# EAGLE design CPLD_Class (EAGLE 5.11)

## Sheet 1 of 6
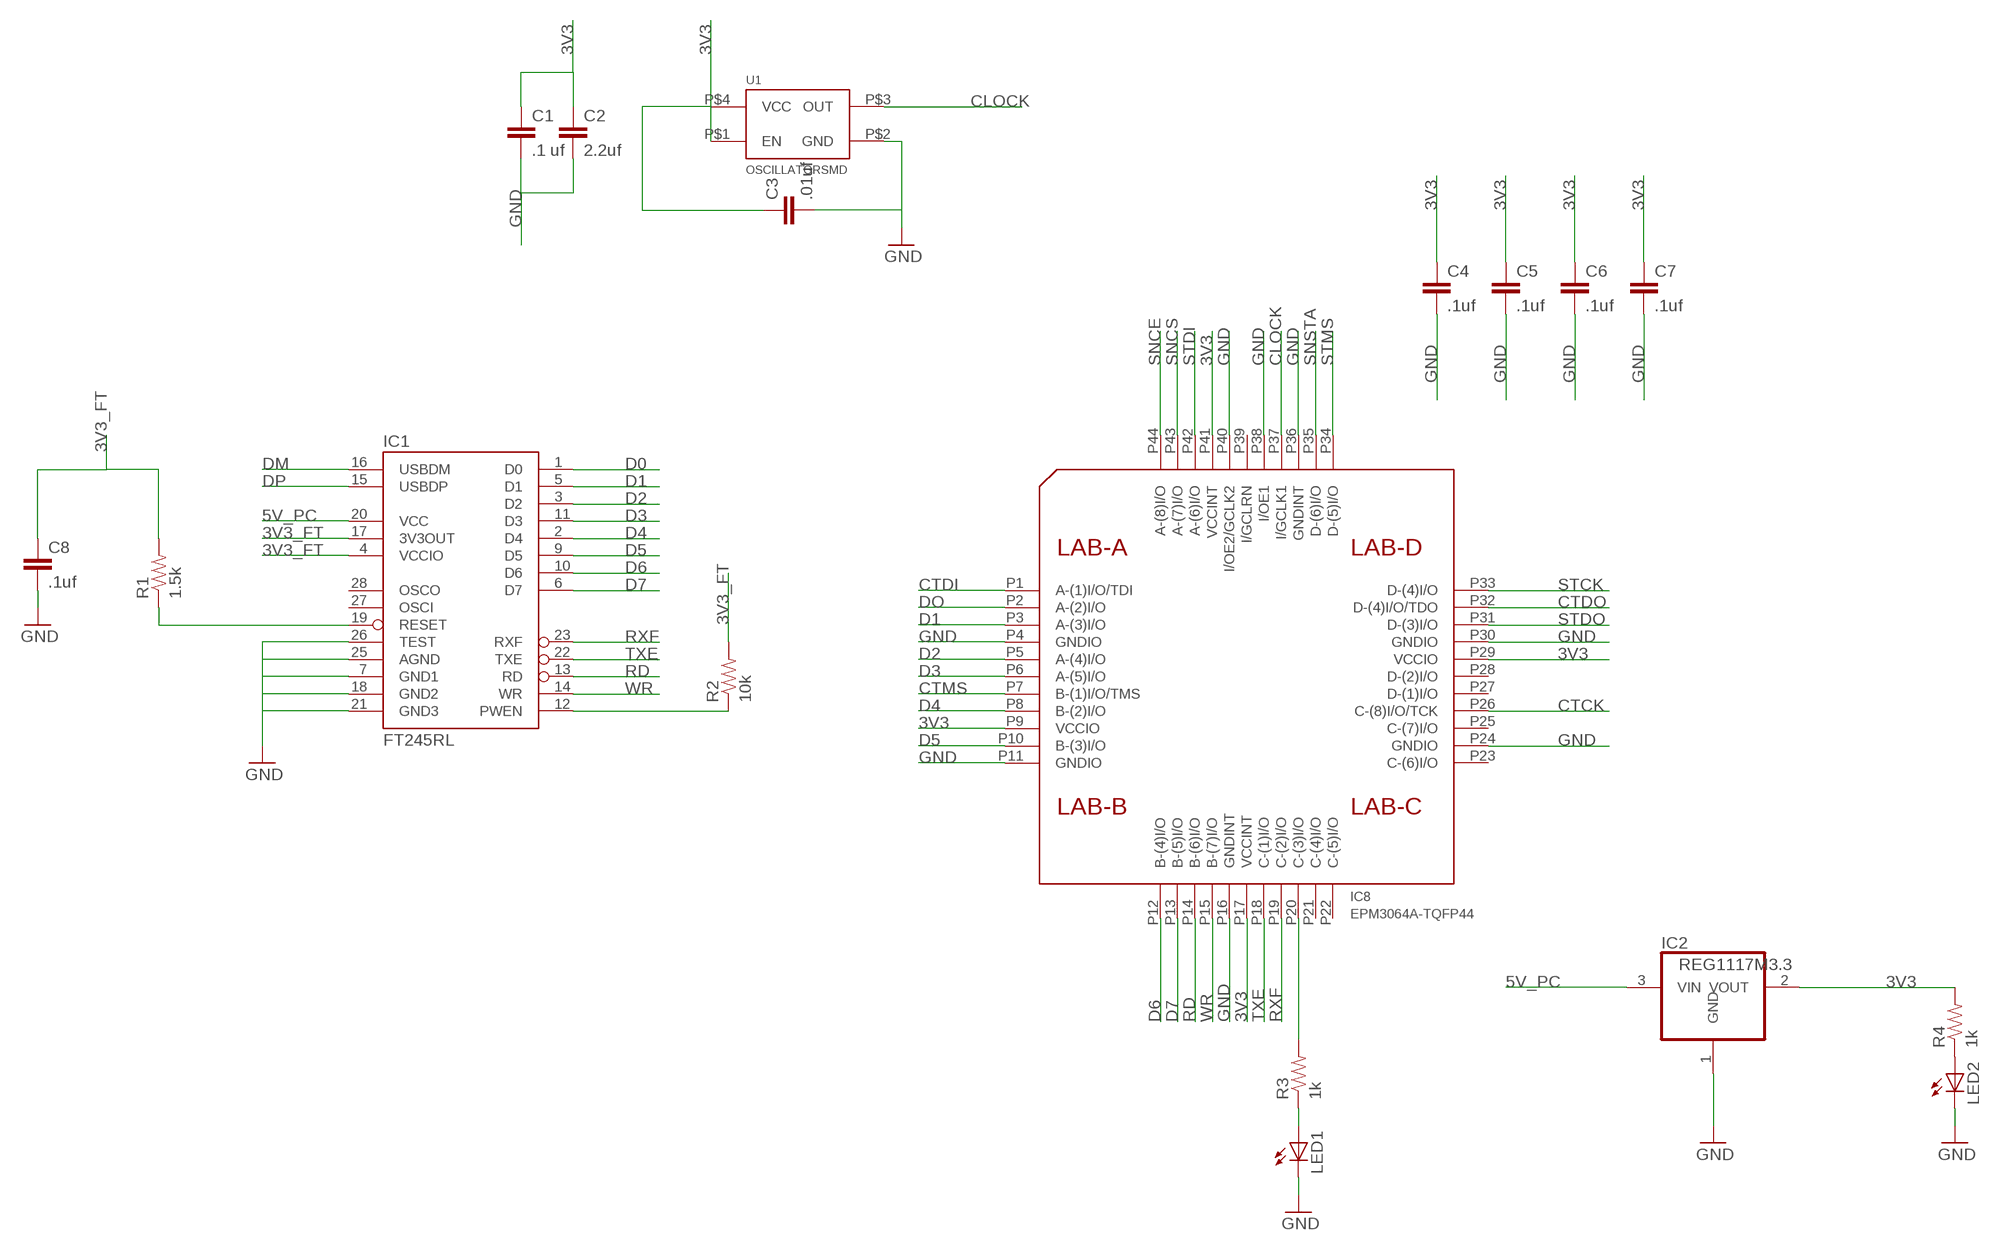
[diagram p0: schematic, sheet 1]

### Parts
C1  .1 uf  CAP0805  [0805]
C2  2.2uf  CAP0805  [0805]
C3  .01uf  CAP0805  [0805]
C4  .1uf  CAP0805  [0805]
C5  .1uf  CAP0805  [0805]
C6  .1uf  CAP0805  [0805]
C7  .1uf  CAP0805  [0805]
C8  .1uf  CAP0805  [0805]
IC1  FT245RL  [SSOP28DB]
IC2  REG1117M3.3  REG1117  [SOT223]
IC8  EPM3064A-TQFP44  [TQFP44]
LED1  LEDCHIPLED_1206  [CHIPLED_1206]
LED2  LEDCHIPLED_1206  [CHIPLED_1206]
R1  1.5k  RESISTOR  [0805]
R2  10k  RESISTOR  [0805]
R3  1k  RESISTOR  [0805]
R4  1k  RESISTOR  [0805]
U1  OSCILLATORSMD  [CRYSTAL-SMD-7X5]

### Nets
3V3: C1.1 C2.1 C3.1 C4.1 C5.1 C6.1 C7.1 IC2.2(VOUT) IC8.P9(VCCIO) IC8.P17(VCCINT) IC8.P29(VCCIO) IC8.P41(VCCINT) R4.2 U1.P$1(EN) U1.P$4(VCC) ; also sheet 3,4
3V3_FT: C8.1 IC1.4(VCCIO) IC1.17(3V3OUT) R1.2 R2.2
5V_PC: IC1.20(VCC) IC2.3(VIN) ; also sheet 2
CLOCK: IC8.P37(I/GCLK1) U1.P$3(OUT)
CTCK: IC8.P26(C-(8)I/O/TCK) ; also sheet 3
CTDI: IC8.P1(A-(1)I/O/TDI) ; also sheet 3
CTDO: IC8.P32(D-(4)I/O/TDO) ; also sheet 3
CTMS: IC8.P7(B-(1)I/O/TMS) ; also sheet 3
D0: IC1.1(D0)
D1: IC1.5(D1) IC8.P3(A-(3)I/O)
D2: IC1.3(D2) IC8.P5(A-(4)I/O)
D3: IC1.11(D3) IC8.P6(A-(5)I/O)
D4: IC1.2(D4) IC8.P8(B-(2)I/O)
D5: IC1.9(D5) IC8.P10(B-(3)I/O)
D6: IC1.10(D6) IC8.P12(B-(4)I/O)
D7: IC1.6(D7) IC8.P13(B-(5)I/O)
DM: IC1.16(USBDM) ; also sheet 2
DO: IC8.P2(A-(2)I/O)
DP: IC1.15(USBDP) ; also sheet 2
GND: C1.2 C2.2 C3.2 C4.2 C5.2 C6.2 C7.2 C8.2 IC1.7(GND1) IC1.18(GND2) IC1.21(GND3) IC1.25(AGND) IC1.26(TEST) IC2.1(GND) IC8.P4(GNDIO) IC8.P11(GNDIO) IC8.P16(GNDINT) IC8.P24(GNDIO) IC8.P30(GNDIO) IC8.P36(GNDINT) IC8.P38(I/OE1) IC8.P40(I/OE2/GCLK2) LED1.C LED2.C U1.P$2(GND) ; also sheet 2,3,4,5,6
N$2: LED2.A R4.1
N$3: LED1.A R3.1
N$4: IC1.19(RESET) R1.1
N$8: IC1.12(PWEN) R2.1
N$13: IC8.P20(C-(3)I/O) R3.2
RD: IC1.13(RD) IC8.P14(B-(6)I/O)
RXF: IC1.23(RXF) IC8.P19(C-(2)I/O)
SNCE: IC8.P44(A-(8)I/O) ; also sheet 4
SNCS: IC8.P43(A-(7)I/O) ; also sheet 4
SNSTA: IC8.P35(D-(6)I/O) ; also sheet 4
STCK: IC8.P33(D-(4)I/O) ; also sheet 4
STDI: IC8.P42(A-(6)I/O) ; also sheet 4
STDO: IC8.P31(D-(3)I/O) ; also sheet 4
STMS: IC8.P34(D-(5)I/O) ; also sheet 4
TXE: IC1.22(TXE) IC8.P18(C-(1)I/O)
WR: IC1.14(WR) IC8.P15(B-(7)I/O)
Unconnected: IC1.27(OSCI) IC1.28(OSCO) IC8.P21(C-(4)I/O) IC8.P22(C-(5)I/O) IC8.P23(C-(6)I/O) IC8.P25(C-(7)I/O) IC8.P27(D-(1)I/O) IC8.P28(D-(2)I/O) IC8.P39(I/GCLRN)

## Sheet 2 of 6
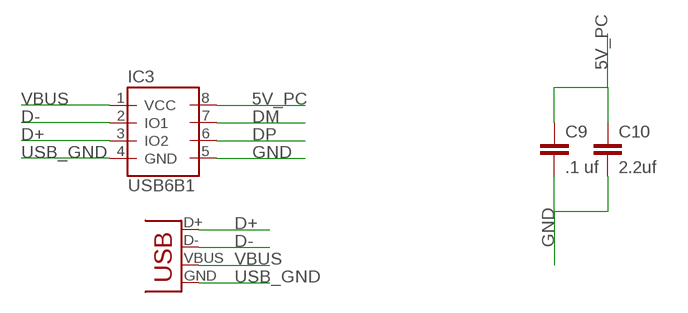
[diagram p1: schematic, sheet 2]

### Parts
C9  .1 uf  CAP0805  [0805]
C10  2.2uf  CAP0805  [0805]
IC3  USB6B1  [SO08]
USB1  USB-SMD-NS  [USB-MINIB-NOSTOP]

### Nets
5V_PC: C9.1 C10.1 IC3.8(VCC) ; also sheet 1
D+: IC3.3(IO2) USB1.D+
D-: IC3.2(IO1) USB1.D-
DM: IC3.7(IO1) ; also sheet 1
DP: IC3.6(IO2) ; also sheet 1
GND: C9.2 C10.2 IC3.5(GND) ; also sheet 1,3,4,5,6
USB_GND: IC3.4(GND) USB1.GND
VBUS: IC3.1(VCC) USB1.VBUS

## Sheet 3 of 6
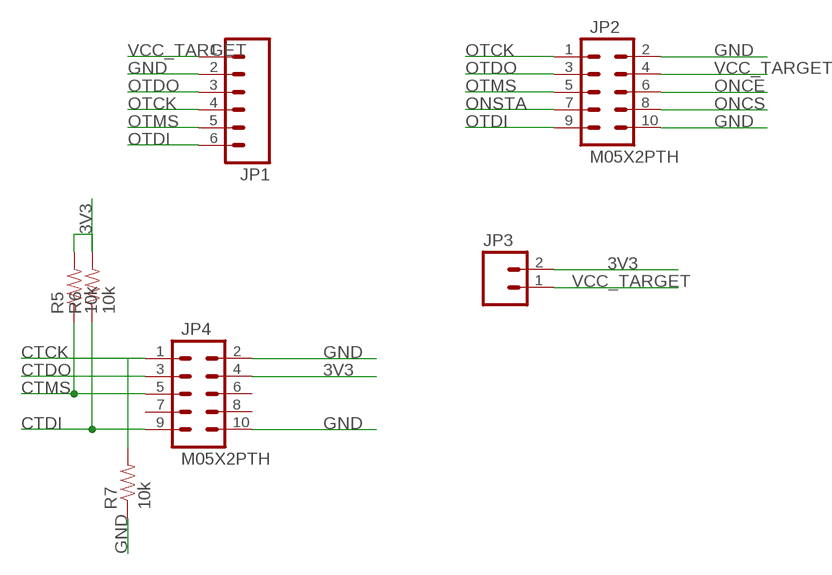
[diagram p2: schematic, sheet 3]

### Parts
JP1  M06SIP  [1X06]
JP2  M05X2PTH  [AVR_ICSP]
JP3  M02PTH  [1X02]
JP4  M05X2PTH  [AVR_ICSP]
R5  10k  RESISTOR  [0805]
R6  10k  RESISTOR  [0805]
R7  10k  RESISTOR  [0805]

### Nets
3V3: JP3.2 JP4.4 R5.2 R6.2 ; also sheet 1,4
CTCK: JP4.1 R7.2 ; also sheet 1
CTDI: JP4.9 R6.1 ; also sheet 1
CTDO: JP4.3 ; also sheet 1
CTMS: JP4.5 R5.1 ; also sheet 1
GND: JP1.2 JP2.2 JP2.10 JP4.2 JP4.10 R7.1 ; also sheet 1,2,4,5,6
ONCE: JP2.6 ; also sheet 4
ONCS: JP2.8 ; also sheet 4
ONSTA: JP2.7 ; also sheet 4
OTCK: JP1.4 JP2.1 ; also sheet 4
OTDI: JP1.6 JP2.9 ; also sheet 4
OTDO: JP1.3 JP2.3 ; also sheet 4
OTMS: JP1.5 JP2.5 ; also sheet 4
VCC_TARGET: JP1.1 JP2.4 JP3.1
Unconnected: JP4.6 JP4.7 JP4.8

## Sheet 4 of 6
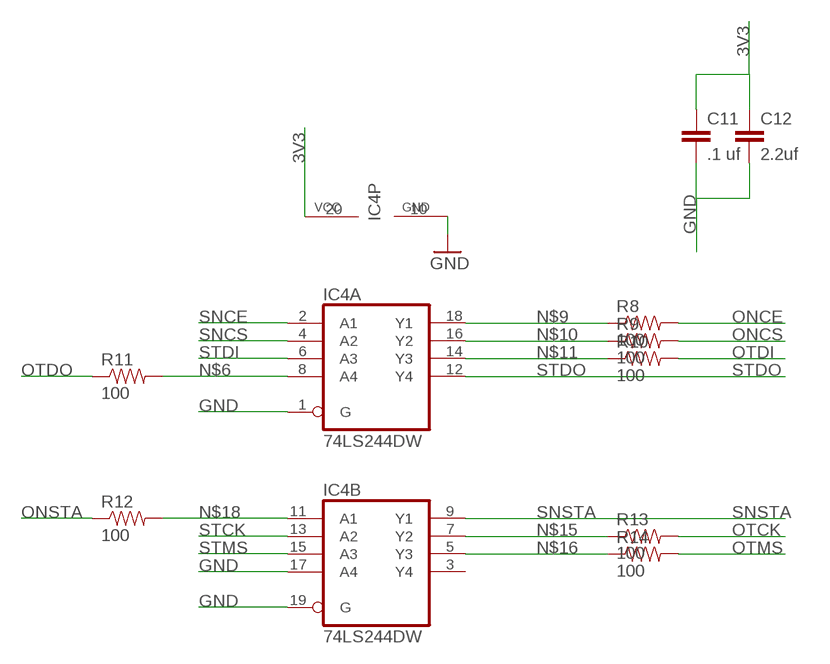
[diagram p3: schematic, sheet 4]

### Parts
C11  .1 uf  CAP0805  [0805]
C12  2.2uf  CAP0805  [0805]
IC4  74LS244DW  [SO20W]
R8  100  RESISTOR  [0805]
R9  100  RESISTOR  [0805]
R10  100  RESISTOR  [0805]
R11  100  RESISTOR  [0805]
R12  100  RESISTOR  [0805]
R13  100  RESISTOR  [0805]
R14  100  RESISTOR  [0805]

### Nets
3V3: C11.1 C12.1 IC4.20(P:VCC) ; also sheet 1,3
GND: C11.2 C12.2 IC4.1(A:G) IC4.10(P:GND) IC4.17(B:A4) IC4.19(B:G) ; also sheet 1,2,3,5,6
N$6: IC4.8(A:A4) R11.2
N$9: IC4.18(A:Y1) R8.1
N$10: IC4.16(A:Y2) R9.1
N$11: IC4.14(A:Y3) R10.1
N$15: IC4.7(B:Y2) R13.1
N$16: IC4.5(B:Y3) R14.1
N$18: IC4.11(B:A1) R12.2
ONCE: R8.2 ; also sheet 3
ONCS: R9.2 ; also sheet 3
ONSTA: R12.1 ; also sheet 3
OTCK: R13.2 ; also sheet 3
OTDI: R10.2 ; also sheet 3
OTDO: R11.1 ; also sheet 3
OTMS: R14.2 ; also sheet 3
SNCE: IC4.2(A:A1) ; also sheet 1
SNCS: IC4.4(A:A2) ; also sheet 1
SNSTA: IC4.9(B:Y1) ; also sheet 1
STCK: IC4.13(B:A2) ; also sheet 1
STDI: IC4.6(A:A3) ; also sheet 1
STDO: IC4.12(A:Y4) ; also sheet 1
STMS: IC4.15(B:A3) ; also sheet 1
Unconnected: IC4.3(B:Y4)

## Sheet 5 of 6
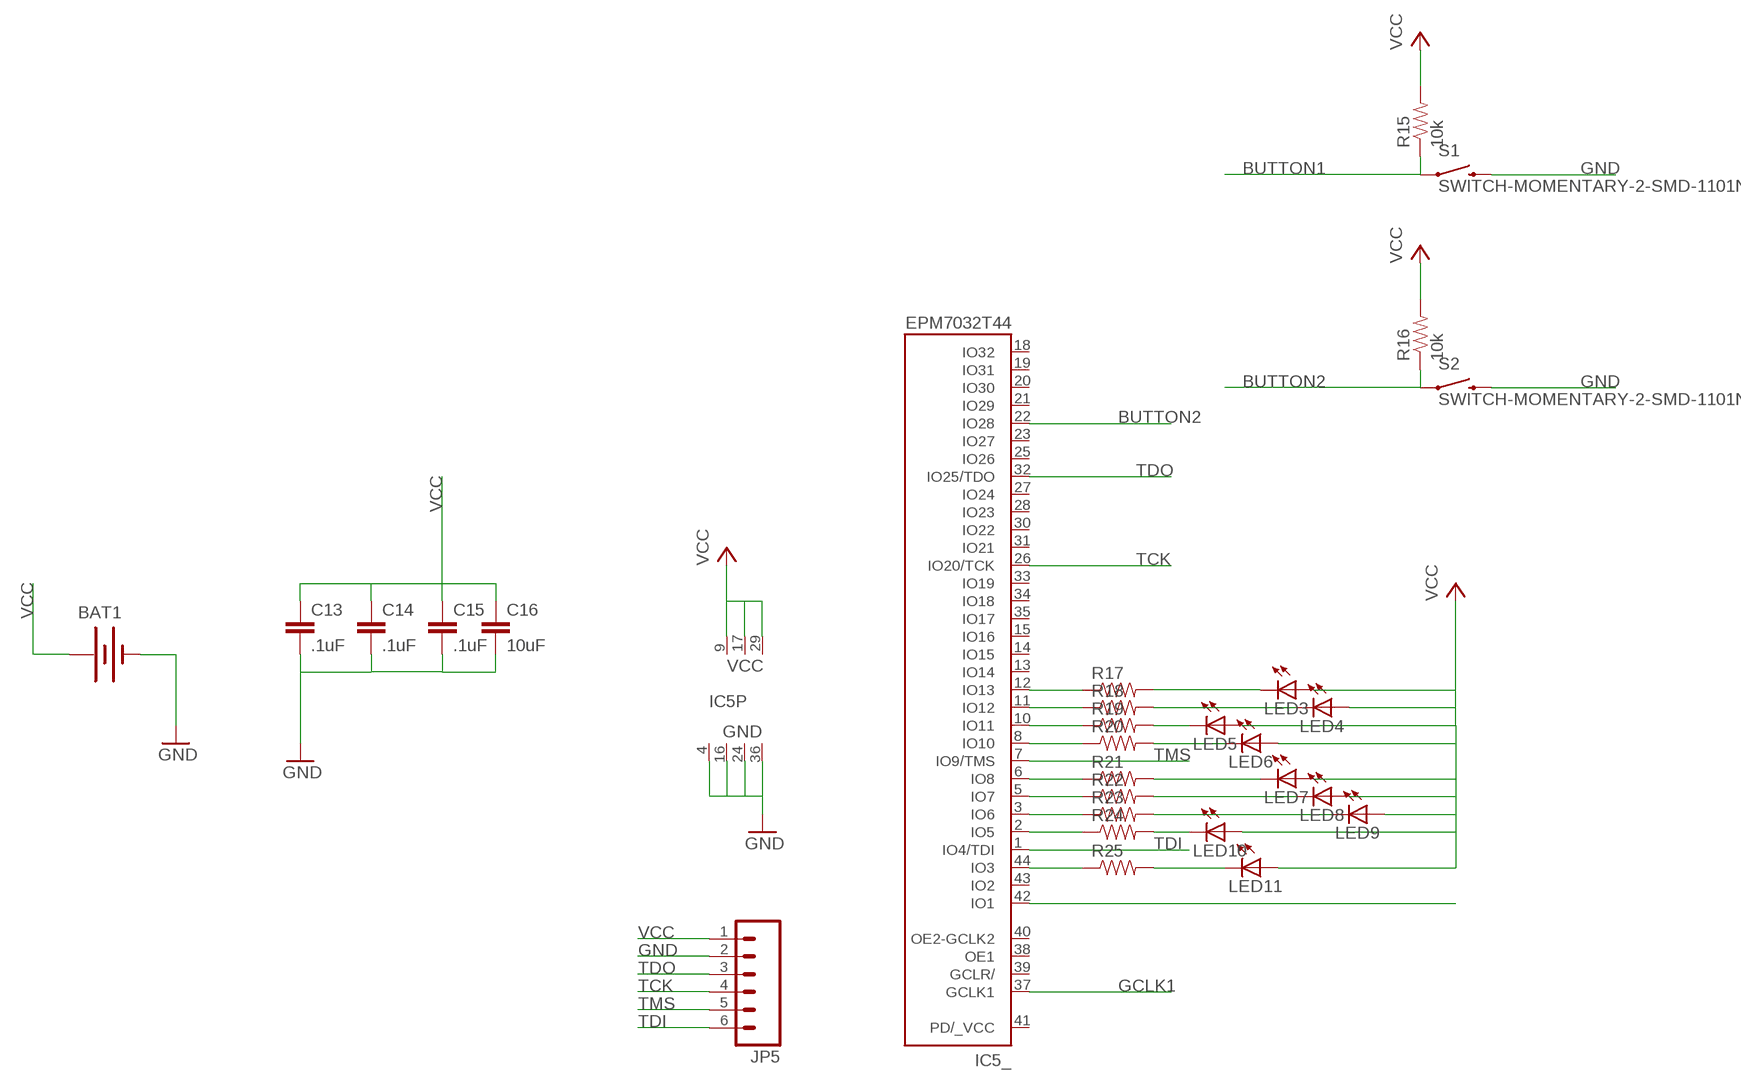
[diagram p4: schematic, sheet 5]

### Parts
BAT1  BATTERY20SMD  [BATTCON_20MM]
C13  .1uF  CAP0805  [0805]
C14  .1uF  CAP0805  [0805]
C15  .1uF  CAP0805  [0805]
C16  10uF  CAP0805  [0805]
IC5  EPM7032T44  [TQFP44]
JP5  M06SIP  [1X06]
LED3  LEDCHIPLED_1206  [CHIPLED_1206]
LED4  LEDCHIPLED_1206  [CHIPLED_1206]
LED5  LEDCHIPLED_1206  [CHIPLED_1206]
LED6  LEDCHIPLED_1206  [CHIPLED_1206]
LED7  LEDCHIPLED_1206  [CHIPLED_1206]
LED8  LEDCHIPLED_1206  [CHIPLED_1206]
LED9  LEDCHIPLED_1206  [CHIPLED_1206]
LED10  LEDCHIPLED_1206  [CHIPLED_1206]
LED11  LEDCHIPLED_1206  [CHIPLED_1206]
R15  10k  RESISTOR  [0805]
R16  10k  RESISTOR  [0805]
R17  RESISTOR  [0805]
R18  RESISTOR  [0805]
R19  RESISTOR  [0805]
R20  RESISTOR  [0805]
R21  RESISTOR  [0805]
R22  RESISTOR  [0805]
R23  RESISTOR  [0805]
R24  RESISTOR  [0805]
R25  RESISTOR  [0805]
S1  SWITCH-MOMENTARY-2-SMD-1101NE  [TACTILE-SWITCH-1101NE]
S2  SWITCH-MOMENTARY-2-SMD-1101NE  [TACTILE-SWITCH-1101NE]

### Nets
BUTTON1: IC5.42(_:IO1) R15.1 S1.P$1
BUTTON2: IC5.22(_:IO28) R16.1 S2.P$1
GCLK1: IC5.37(_:GCLK1) ; also sheet 6
GND: BAT1.2(-) C13.2 C14.2 C15.2 C16.2 IC5.4(P:GND) IC5.16(P:GND) IC5.24(P:GND) IC5.36(P:GND) JP5.2 S1.P$2 S2.P$2 ; also sheet 1,2,3,4,6
N$1: LED5.C R19.2
N$5: LED6.C R20.2
N$7: LED9.C R23.2
N$12: LED7.C R21.2
N$14: LED8.C R22.2
N$17: LED10.C R24.2
N$19: LED11.C R25.2
N$20: LED3.C R17.2
N$22: IC5.12(_:IO13) R17.1
N$23: IC5.11(_:IO12) R18.1
N$24: IC5.10(_:IO11) R19.1
N$25: IC5.8(_:IO10) R20.1
N$26: IC5.6(_:IO8) R21.1
N$27: IC5.5(_:IO7) R22.1
N$28: IC5.3(_:IO6) R23.1
N$29: IC5.2(_:IO5) R24.1
N$30: IC5.44(_:IO3) R25.1
N$35: LED4.C R18.2
TCK: IC5.26(_:IO20/TCK) JP5.4
TDI: IC5.1(_:IO4/TDI) JP5.6
TDO: IC5.32(_:IO25/TDO) JP5.3
TMS: IC5.7(_:IO9/TMS) JP5.5
VCC: BAT1.1(+) C13.1 C14.1 C15.1 C16.1 IC5.9(P:VCC) IC5.17(P:VCC) IC5.29(P:VCC) JP5.1 LED3.A LED4.A LED5.A LED6.A LED7.A LED8.A LED9.A LED10.A LED11.A R15.2 R16.2 ; also sheet 6
Unconnected: IC5.13(_:IO14) IC5.14(_:IO15) IC5.15(_:IO16) IC5.18(_:IO32) IC5.19(_:IO31) IC5.20(_:IO30) IC5.21(_:IO29) IC5.23(_:IO27) IC5.25(_:IO26) IC5.27(_:IO24) IC5.28(_:IO23) IC5.30(_:IO22) IC5.31(_:IO21) IC5.33(_:IO19) IC5.34(_:IO18) IC5.35(_:IO17) IC5.38(_:OE1) IC5.39(_:GCLR/) IC5.40(_:OE2-GCLK2) IC5.41(_:PD/_VCC) IC5.43(_:IO2)

## Sheet 6 of 6
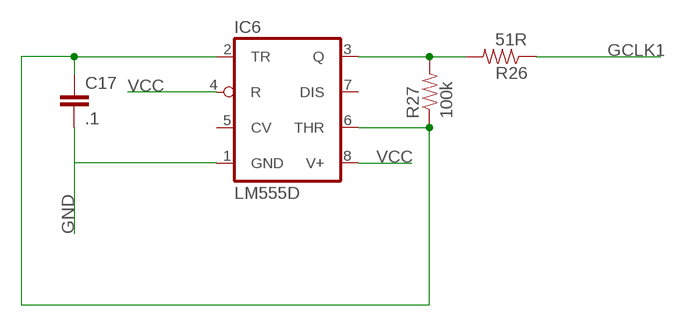
[diagram p5: schematic, sheet 6]

### Parts
C17  .1  CAP0805  [0805]
IC6  LM555D  [SO08]
R26  51R  RESISTOR  [0805]
R27  100k  RESISTOR  [0805]

### Nets
GCLK1: R26.1 ; also sheet 5
GND: C17.2 IC6.1(GND) ; also sheet 1,2,3,4,5
N$39: IC6.3(Q) R26.2 R27.2
N$40: C17.1 IC6.2(TR) IC6.6(THR) R27.1
VCC: IC6.4(R) IC6.8(V+) ; also sheet 5
Unconnected: IC6.5(CV) IC6.7(DIS)

## Library data of the parts
BAT1 = SparkFun:BATTERY: Battery Holders Various common sizes : AA, AAA, 20mm coin cell and 12mm coin cell.
C1 C2 C4-C7 C9-C17 = SparkFun:CAP: Capacitor Standard 0603 ceramic capacitor, and 0.1" leaded capacitor.
C3 C8 = NSL_CylonIV:CAP: Capacitor Standard 0603 ceramic capacitor, and 0.1" leaded capacitor.
IC1 = SparkFun:FT245RL: USB FIFO Controller 4th Generation USB Controller (USB <-> Parallel) - FIFO. Spark Fun Electronics SKU : COM-00787
IC2 = burr-brown:REG1117: 800mA and 1A Low Dropout (LDO) Positive Regulator 1.8V, 2.5V, 2.85V, 3.3V, 5V, and Adj; MPN: REG1117; OC_FARNELL: 1097566; OC_NEWARK: 14P6981
IC3 = st-microelectronics:USB6B1: DATA LINES PROTECTION Source: http://www.st.com/stonline/products/literature/ds/5605.pdf; MPN: USB6B1; OC_FARNELL: 9804358; OC_NEWARK: 26M4750
IC4 = 74xx-us:74*244: Octal BUFFER and LINE DRIVER, 3-state
IC5 = altera:EPM7032: EPM7032 MAX 7000 family; MPN: EPM7032SLC44-6N; OC_FARNELL: 1549447; OC_NEWARK: 51R9532
IC6 = linear:*555: TIMER
IC8 = dp_devices:EPM3064A: 64 Macrocells 3.3V CPLD
JP1 JP5 = SparkFun:M06: Header 6 Standard 6-pin 0.1" header. Use with straight break away headers (SKU : PRT-00116), right angle break away headers (PRT-00553), swiss pins (PRT-00743), machine pins (PRT-00117), and female headers (PRT-00115). Molex polarized connector foot print use with SKU : PRT-08094 with associated crimp pins and housings. NOTES ON THE VARIANTS LOCK and LOCK_LONGPADS... This footprint was designed to help hold the alignment of a through-hole component (i.e. 6-pin header) while soldering it into place. You may notice that each hole has been shifted either up or down by 0.005 of an inch from it's more standard position (which is a perfectly straight line). This slight alteration caused the pins (the squares in the middle) to touch the edges of the holes. Because they are alternating, it causes a "brace" to hold the component in place. 0.005 has proven to be the perfect amount of "off-center" position when using our standard breakaway headers. Although looks a little odd when you look at the bare footprint, once you have a header in there, the alteration is very hard to notice. Also, if you push a header all the way into place, it is covered up entirely on the bottom side. This idea of altering the position of holes to aid alignment will be further integrated into the Sparkfun Library for other footprints. It can help hold any component with 3 or more connection pins.
JP2 JP4 = SparkFun:M05X2: Header 5x2 Standard 10-pin dual row 0.1" header. Commonly used with AVR-ISP. Use with Spark Fun Electronics SKU: PRT-00778
JP3 = SparkFun:M02: Header 2 Standard 2-pin 0.1" header. Use with straight break away headers (SKU : PRT-00116), right angle break away headers (PRT-00553), swiss pins (PRT-00743), machine pins (PRT-00117), and female headers (PRT-00115). Molex polarized connector foot print use with SKU : PRT-08233 with associated crimp pins and housings.
LED1-LED11 = led:LED: LED OSRAM: - CHIPLED LG R971, LG N971, LY N971, LG Q971, LY Q971, LO R971, LY R971 LH N974, LH R974 LS Q976, LO Q976, LY Q976 LO Q996 - Hyper CHIPLED LW Q18S LB Q993, LB Q99A, LB R99A - SideLED LS A670, LO A670, LY A670, LG A670, LP A670 LB A673, LV A673, LT A673, LW A673 LH A674 LY A675 LS A676, LA A676, LO A676, LY A676, LW A676 LS A679, LY A679, LG A679 - Hyper Micro SIDELED® LS Y876, LA Y876, LO Y876, LY Y876 LT Y87S - SmartLED LW L88C, LW L88S LB L89C, LB L89S, LG L890 LS L89K, LO L89K, LY L89K LS L896, LA L896, LO L896, LY L896 - TOPLED LS T670, LO T670, LY T670, LG T670, LP T670 LSG T670, LSP T670, LSY T670, LOP T670, LYG T670 LG T671, LOG T671, LSG T671 LB T673, LV T673, LT T673, LW T673 LH T674 LS T676, LA T676, LO T676, LY T676, LB T676, LH T676, LSB T676, LW T676 LB T67C, LV T67C, LT T67C, LS T67K, LO T67K, LY T67K, LW E67C LS E67B, LA E67B, LO E67B, LY E67B, LB E67C, LV E67C, LT E67C LW T67C LS T679, LY T679, LG T679 LS T770, LO T770, LY T770, LG T770, LP T770 LB T773, LV T773, LT T773, LW T773 LH T774 LS E675, LA E675, LY E675, LS T675 LS T776, LA T776, LO T776, LY T776, LB T776 LHGB T686 LT T68C, LB T68C - Hyper Mini TOPLED® LB M676 - Mini TOPLED Santana® LG M470 LS M47K, LO M47K, LY M47K Source: http://www.osram.convergy.de LUXEON: - LUMILED® LXK2-PW12-R00, LXK2-PW12-S00, LXK2-PW14-U00, LXK2-PW14-V00 LXK2-PM12-R00, LXK2-PM12-S00, LXK2-PM14-U00 LXK2-PE12-Q00, LXK2-PE12-R00, LXK2-PE12-S00, LXK2-PE14-T00, LXK2-PE14-U00 LXK2-PB12-K00, LXK2-PB12-L00, LXK2-PB12-M00, LXK2-PB14-N00, LXK2-PB14-P00, LXK2-PB14-Q00 LXK2-PR12-L00, LXK2-PR12-M00, LXK2-PR14-Q00, LXK2-PR14-R00 LXK2-PD12-Q00, LXK2-PD12-R00, LXK2-PD12-S00 LXK2-PH12-R00, LXK2-PH12-S00 LXK2-PL12-P00, LXK2-PL12-Q00, LXK2-PL12-R00 Source: www.luxeon.com KINGBRIGHT: KA-3528ASYC Source: www.kingbright.com
R1-R3 = NSL_CylonIV:RESISTOR: Resistor Basic schematic elements and footprints for 0603, 1206, and PTH 1/10th watt (small) resistors.
R4-R27 = TVbNull-Laser:RESISTOR: Resistor Basic schematic elements and footprints for 0603, 1206, and PTH 1/10th watt (small) resistors.
S1 S2 = NSL_RFIDdle:SWITCH-MOMENTARY-2
U1 = Prg_CPLD:OSCILLATOR
USB1 = SparkFun:USB: USB Connectors USB-B-PTH is fully proven SKU : PRT-00139 USB-miniB is fully proven SKU : PRT-00587 USB-A-PCB is untested. USB-A-H is throughly reviewed, but untested. Spark Fun Electronics SKU : PRT-00437 USB-B-SMT is throughly reviewed, but untested. Needs silkscreen touching up. USB-A-S has not been used/tested USB-MB-H has not been used/tested

## Board
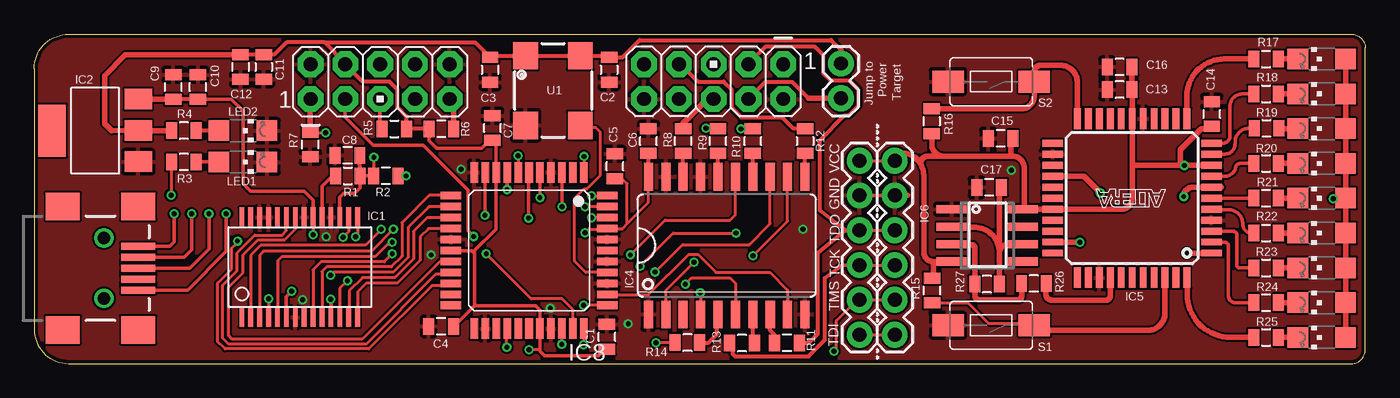
[diagram p6: board, top side]
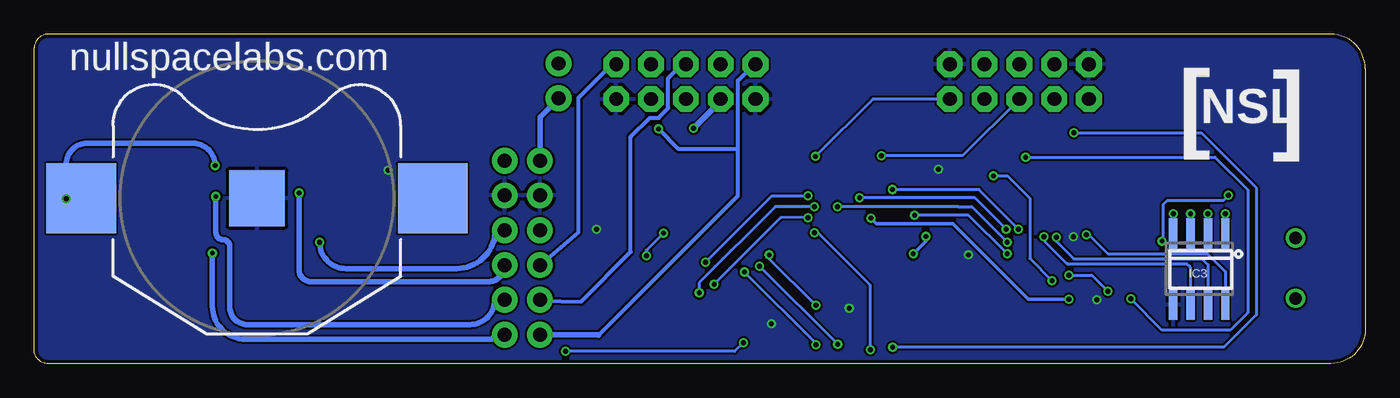
[diagram p7: board, bottom side, seen from below]

Size 97.16 x 24.03 mm. Coordinates in mm from the lower left corner, seen from the top.
Outline: 0,21.53 arc-90 2.5,24.03 96.16,24.03 arc-90 97.16,23.03 97.16,1 arc-90 96.16,0 2.5,0 arc-90 0,2.5 0,21.53
Copper layers (1*16): Top 0.035mm / dielectric 1.5mm / Bottom 0.035mm
Design rules "ITead_rule": minimum track width 6mil, minimum drill 12mil, track to track 6mil, track to pad 6mil, pad to pad 6mil, via to via 6mil, smd to smd 0mil, copper to edge 10mil, drill to drill 10mil, minimum pad ring 10mil, minimum via ring 6mil, stop-mask expansion 2mil, vias tented up to drill 100mil, thermal gap 10mil

### Footprints (pad centres in the part's own frame; a part is rotated, then mirrored left to right if it is on the bottom)
BATTCON_20MM = smd 5.08 x 5.08: 1 -12.827,0; 3 12.827,0 | smd 4.064 x 4.064: 2 0,0
0805 = smd 0.8 x 1.2: 1 -0.9,0; 2 0.9,0
SSOP28DB = smd 0.348 x 1.397: 1 -4.225,-3.656; 2 -3.575,-3.656; 3 -2.925,-3.656; 4 -2.275,-3.656; 5 -1.625,-3.656; 6 -0.975,-3.656; 7 -0.325,-3.656; 8 0.325,-3.656; 9 0.975,-3.656; 10 1.625,-3.656; 11 2.275,-3.656; 12 2.925,-3.656; 13 3.575,-3.656; 14 4.225,-3.656; 15 4.225,3.656; 16 3.575,3.656; 17 2.925,3.656; 18 2.275,3.656; 19 1.625,3.656; 20 0.975,3.656; 21 0.325,3.656; 22 -0.325,3.656; 23 -0.975,3.656; 24 -1.625,3.656; 25 -2.275,3.656; 26 -2.925,3.656; 27 -3.575,3.656; 28 -4.225,3.656
SOT223 = smd 1.499 x 2.007: 1 -2.261,-3.15; 2 0.025,-3.15; 3 2.311,-3.15 | smd 3.81 x 2.007: 4 0,3.15
SO08 = smd 0.6 x 2.2: 1 -1.905,-2.6; 2 -0.635,-2.6; 3 0.635,-2.6; 4 1.905,-2.6; 5 1.905,2.6; 6 0.635,2.6; 7 -0.635,2.6; 8 -1.905,2.6
SO20W = smd 0.66 x 2.032: 1 -5.715,-5.029; 2 -4.445,-5.029; 3 -3.175,-5.029; 4 -1.905,-5.029; 5 -0.635,-5.029; 6 0.635,-5.029; 7 1.905,-5.029; 8 3.175,-5.029; 9 4.445,-5.029; 10 5.715,-5.029; 11 5.715,5.029; 12 4.445,5.029; 13 3.175,5.029; 14 1.905,5.029; 15 0.635,5.029; 16 -0.635,5.029; 17 -1.905,5.029; 18 -3.175,5.029; 19 -4.445,5.029; 20 -5.715,5.029
TQFP44 = smd 1.5 x 0.5: 1 -5.8,4; 2 -5.8,3.2; 3 -5.8,2.4; 4 -5.8,1.6; 5 -5.8,0.8; 6 -5.8,0; 7 -5.8,-0.8; 8 -5.8,-1.6; 9 -5.8,-2.4; 10 -5.8,-3.2; 11 -5.8,-4; 23 5.8,-4; 24 5.8,-3.2; 25 5.8,-2.4; 26 5.8,-1.6; 27 5.8,-0.8; 28 5.8,0; 29 5.8,0.8; 30 5.8,1.6; 31 5.8,2.4; 32 5.8,3.2; 33 5.8,4 | smd 0.5 x 1.5: 12 -4,-5.8; 13 -3.2,-5.8; 14 -2.4,-5.8; 15 -1.6,-5.8; 16 -0.8,-5.8; 17 0,-5.8; 18 0.8,-5.8; 19 1.6,-5.8; 20 2.4,-5.8; 21 3.2,-5.8; 22 4,-5.8; 34 4,5.8; 35 3.2,5.8; 36 2.4,5.8; 37 1.6,5.8; 38 0.8,5.8; 39 0,5.8; 40 -0.8,5.8; 41 -1.6,5.8; 42 -2.4,5.8; 43 -3.2,5.8; 44 -4,5.8
TQFP44' = smd 0.55 x 1.5: P1 -4,-5.7; P2 -3.2,-5.7; P3 -2.4,-5.7; P4 -1.6,-5.7; P5 -0.8,-5.7; P6 0,-5.7; P7 0.8,-5.7; P8 1.6,-5.7; P9 2.4,-5.7; P10 3.2,-5.7; P11 4,-5.7; P23 4,5.7; P24 3.2,5.7; P25 2.4,5.7; P26 1.6,5.7; P27 0.8,5.7; P28 0,5.7; P29 -0.8,5.7; P30 -1.6,5.7; P31 -2.4,5.7; P32 -3.2,5.7; P33 -4,5.7 | smd 1.5 x 0.55: P12 5.7,-4; P13 5.7,-3.2; P14 5.7,-2.4; P15 5.7,-1.6; P16 5.7,-0.8; P17 5.7,0; P18 5.7,0.8; P19 5.7,1.6; P20 5.7,2.4; P21 5.7,3.2; P22 5.7,4; P34 -5.7,4; P35 -5.7,3.2; P36 -5.7,2.4; P37 -5.7,1.6; P38 -5.7,0.8; P39 -5.7,0; P40 -5.7,-0.8; P41 -5.7,-1.6; P42 -5.7,-2.4; P43 -5.7,-3.2; P44 -5.7,-4
1X06 = drill 1.016 pad 1.88 round: 1 0,0; 2 2.54,0; 3 5.08,0; 4 7.62,0; 5 10.16,0; 6 12.7,0
AVR_ICSP = drill 1.016 pad 1.88 octagon: 1 -1.27,5.08; 2 1.27,5.08; 3 -1.27,2.54; 4 1.27,2.54; 5 -1.27,0; 6 1.27,0; 7 -1.27,-2.54; 8 1.27,-2.54; 9 -1.27,-5.08; 10 1.27,-5.08
1X02 = drill 1.016 pad 1.88 round: 1 0,0; 2 2.54,0
CHIPLED_1206 = smd 1.5 x 1.5: A 0,-1.75; C 0,1.75
TACTILE-SWITCH-1101NE = smd 2.3 x 1.6: P$1 -3.15,0; P$2 3.15,0
CRYSTAL-SMD-7X5 = smd 2 x 1.8: P$1 -2.54,-2; P$2 2.54,-2; P$3 2.54,2; P$4 -2.54,2
USB-MINIB-NOSTOP = smd 2.5 x 0.5: D+ 2.5,0; D- 2.5,0.8; GND 2.5,-1.6; ID 2.5,-0.8; VBUS 2.5,1.6 | smd 2.5 x 2: G1 -3,-4.5; G2 -3,4.5; G3 2.5,4.5; G4 2.5,-4.5 | drill 0.9 pad 0.8 round: H1 0,2.2 | drill 0.9 pad 0.787 round: H2 0,-2.2

### Placement (x,y rotation side)
BAT1  80.9,12.06 0 bottom
C1  41.81,1.96 90 top
C2  41.96,21.44 270 top
C3  33.27,21.44 270 top
C4  29.7,2.71 180 top
C5  42.38,14.4 90 top
C6  44.83,16.23 90 top
C7  33.45,17.19 90 top
C8  22.87,15.19 180 top
C9  10.16,20.18 90 top
C10  11.95,20.18 90 top
C11  16.76,21.65 270 top
C12  15.06,21.65 270 top
C13  79.22,19.99 180 top
C14  85.95,18.21 90 top
C15  70.54,16.43 180 top
C16  79.22,21.64 180 top
C17  69.7,12.85 180 top
IC1  19.38,7.04 0 top
IC2  4.45,16.99 90 top
IC3  12.12,6.91 180 bottom
IC4  50.55,8.61 0 top
IC5  80.14,12.06 180 top
IC6  69.57,9.35 270 top
IC8  EPM3064A-TQFP44  [TQFP44']  36.12,8.25 180 top
JP1  60.25,14.81 270 top
JP2  49.59,20.57 270 top
JP3  58.88,19.35 90 top
JP4  25.25,20.57 90 top
JP5  62.81,14.81 270 top
LED1  15.24,14.71 270 top
LED2  15.24,16.99 270 top
LED3  93.98,22.23 90 top
LED4  93.98,19.68 90 top
LED5  93.98,17.14 90 top
LED6  93.98,14.6 90 top
LED7  93.98,12.06 90 top
LED8  93.98,9.52 90 top
LED9  93.98,6.98 90 top
LED10  93.98,4.44 90 top
LED11  93.98,1.9 90 top
R1  22.89,13.69 0 top
R2  25.66,13.69 180 top
R3  10.92,14.71 180 top
R4  10.92,16.99 180 top
R5  26.29,17.12 0 top
R6  29.72,17.12 180 top
R7  20.15,15.99 90 top
R8  47.37,16.23 90 top
R9  49.91,16.23 90 top
R10  52.45,16.23 90 top
R11  54.94,1.51 180 top
R12  56.26,16.23 270 top
R13  51.66,1.5 180 top
R14  47.68,1.52 180 top
R15  65.53,5.33 90 top
R16  65.51,17.68 270 top
R17  89.92,22.23 0 top
R18  89.92,19.68 0 top
R19  89.94,17.17 0 top
R20  89.92,14.6 0 top
R21  89.92,12.06 0 top
R22  89.92,9.52 0 top
R23  89.92,6.98 0 top
R24  89.92,4.44 0 top
R25  89.92,1.9 0 top
R26  72.97,5.84 180 top
R27  69.55,5.79 180 top
S1  69.85,2.79 180 top
S2  69.85,20.57 180 top
U1  37.86,19.92 270 top
USB1  5.08,6.96 0 top

### Tracks (layer width: path | path; a pad name or v marks a point on that pad's centre or on a via)
3V3  (via drill 0.36)
  Top 0.203: 43.32,10.25 42.93,9.85 IC8.P41 | 43.32,10.25 44.83,11.76 IC4.20 | IC4.20 | IC8.P41 41.79,9.83 | 33.71,9.8 33.73,9.83 | C5.1 42.92,13.5 43.28,13.13 43.28,10.29 43.32,10.25 | C6.1 | IC8.P41 41.77,9.8 40.46,9.8 v40.21,9.55 | 36.91,1.02 v36.12,1.02
  Top 0.254: IC8.P17 30.44,8.23 31.95,8.23 32.16,8.03 | 32.16,4.22 32.16,8.03 | 32.16,4.22 30.65,2.71 C4.1 | R6.2 28.8,17.11 28.8,16.26 29.36,15.7 32.64,15.7 33.23,16.29 C7.1 33.72,16.02 IC8.P9 33.71,13.94 33.71,9.8 32.16,8.25 32.16,8.03 | 32.16,4.22 36.6,4.22 36.93,3.89 36.93,2.57 IC8.P29 36.91,2.54 36.91,1.02 36.91,0.89 37.24,0.56 41.17,0.56 41.67,1.06 C1.1
  Top 0.305: IC4.20 C6.1 | 15.04,22.53 C12.1 C11.1 17.51,22.55 18.41,23.44 21.18,23.44 | IC2.2 7.49,16.99 | R6.2 R5.2 27.19,18.02 26.52,18.69 26.52,19.99 25.93,20.57 23.98,20.57 JP4.4 22.71,21.92 21.18,23.44 | C3.1 33.3,22.31 | U1.P$4 39.7,22.34 | C3.1 32.17,23.44 21.18,23.44 | C3.1 33.27,22.46 U1.P$1 U1.P$4 | U1.P$4 41.96,22.46 C2.1 42.94,22.34 44.2,23.6 58.17,23.6 58.88,22.88
  Top 0.406: IC2.2 5.64,16.99 5.13,17.5 5.13,21.01 6.66,22.53 15.04,22.53 | 7.49,16.99 R4.2 | 58.88,22.88 JP3.2
  Bottom 0.203: v40.21,9.55 39.95,9.55 36.12,5.71 v36.12,1.02
3V3_FT  (via drill 0.36)
  Top 0.203: IC1.4 v17.12,4.72 | v24.79,15.06 24.76,15.03 R2.2
  Top 0.254: IC1.17 22.3,12.14 22.58,12.42 23.37,12.42 23.79,12.84 R1.2 R2.2
  Top 0.305: R1.2 C8.1
  Bottom 0.203: v17.12,4.72 14.83,2.44 9.86,2.44 8.59,3.71 8.59,12.67 10.97,15.06 v24.79,15.06
5V_PC  (via drill 0.36)
  Top 0.203: IC1.20 20.34,10.68 v20.34,9.4
  Top 0.254: C10.1 11.97,19.3 14.38,19.3 15.24,18.44 15.24,13.13 15.8,12.57 19.71,12.57 20.36,11.93 IC1.20
  Top 0.305: IC2.3 7.47,19.28 | C10.1 C9.1
  Top 0.406: C9.1 IC2.3
  Bottom 0.203: IC3.8 10.21,6.71 11.53,8.03 18.8,8.03 20.17,9.4 v20.34,9.4
BUTTON1
  Top 0.203: 65.54,4.44 68.15,4.44 69.65,2.95 72.85,2.95 arc-90 S1.P$1
  Top 0.406: R15.1 65.54,4.44 | S1.P$1 arc-90 72.77,2.44 81.31,2.44 arc90 82.54,3.67 IC5.42
BUTTON2
  Top 0.406: S2.P$1 72.75,20.88 | IC5.22 76.14,20.54 arc90 74.91,21.77 73.46,21.77 arc90 73,21.31 S2.P$1 | S2.P$1 arc-90 S2.P$1 | R16.1 72.02,18.58 arc90 73,19.56 S2.P$1 | S2.P$1 arc-90 S2.P$1
CLOCK
  Top 0.203: 39.86,17.2 41.02,17.2 41.33,16.89 41.33,13.74 40.34,12.75 40.13,12.75 39.45,12.06 39.45,7.47 40.26,6.65 IC8.P37 | IC8.P37
  Top 0.305: 39.71,17.2 U1.P$3 39.86,17.2
CTCK  (via drill 0.36)
  Top 0.203: IC8.P26 34.49,2.53 v34.49,1.19 | v21.26,16.84 20.2,16.84 R7.2
  Top 0.305: JP4.1 20.15,19.29
  Top 0.406: 20.15,19.29 R7.2
  Bottom 0.203: v34.49,1.19 10.31,1.19 7.95,3.56 7.95,12.83 11.96,16.84 v21.26,16.84
CTDI  (via drill 0.36)
  Top 0.203: IC8.P1 40.12,15.1 v40.13,15.11
  Top 0.406: JP4.9 30.62,19.01 R6.1
  Bottom 0.203: v40.13,15.11 35.94,19.3 JP4.9
CTDO  (via drill 0.36)
  Top 0.203: v33,8 36.27,4.72 38.53,4.72 39.32,3.94 IC8.P32
  Top 0.254: v32.08,9.27 31.67,9.68 31.67,12.65 28.4,15.93 24.74,15.93 22.71,17.96 JP4.3 | IC8.P32
  Bottom 0.254: v33,8 32.08,8.91 v32.08,9.27
CTMS  (via drill 0.36)
  Top 0.203: IC8.P7 35.32,15.15 v35.31,15.16
  Top 0.305: R5.1 25.25,17.01 JP4.5
  Bottom 0.203: v35.31,15.16 29.39,15.16 JP4.5
D1  (via drill 0.36)
  Top 0.203: 17.78,3.4 17.76,3.43 17.76,7.49 18.06,7.8 24.87,7.8 25.96,8.89 v26.14,8.86
  Top 0.254: 17.78,3.4 IC1.5 | v38.53,11.46 38.52,11.47 IC8.P3
  Bottom 0.203: v38.53,11.46 29.72,11.46 28.73,11.46 v26.14,8.86
D2  (via drill 0.36)
  Top 0.203: IC1.3 16.45,7.92 16.74,8.2 24.61,8.2 v26.21,9.8
  Top 0.254: v36.91,12.09 36.92,12.08 IC8.P5
  Bottom 0.203: v26.21,9.8 28.5,12.09 v36.91,12.09
D3  (via drill 0.36)
  Top 0.254: IC8.P6 36.09,13.93 v36.09,10.62 | v21.64,4.7 21.66,4.68 IC1.11
  Bottom 0.254: v36.09,10.62 35.69,10.21 30.1,10.21 24.59,4.7 v21.64,4.7
D4  (via drill 0.36)
  Top 0.203: IC1.2 15.8,7.9 16.54,8.64 24.18,8.64 25.32,9.78 v25.32,9.8 25.3,9.8
  Top 0.254: IC1.2 | v34.52,12.7 | v34.52,12.7 IC8.P8
  Bottom 0.203: v25.32,9.8 28.19,12.7 v34.52,12.7
D5  (via drill 0.36)
  Top 0.203: v26.14,8 25.55,7.42 20.93,7.42 20.36,6.84 IC1.9
  Top 0.254: IC1.9 20.34,3.39 | IC8.P10 32.92,10.9 v32.89,10.82
  Bottom 0.203: v26.14,8 28.96,10.82 v32.89,10.82
D6
  Top 0.203: IC1.10 21.06,3.43 | 30.28,12.39 arc-90 IC8.P12 30.41,12.27 28.83,12.27 26.85,10.29 26.85,7.85 26.06,7.06 21.34,7.06 21.01,6.73 IC1.10
  Top 0.254: IC1.10
D7  (via drill 0.36)
  Top 0.203: v21.64,6.45 21.87,6.68 26.21,6.68 27.3,7.77 27.3,9.96 28.8,11.46 IC8.P13
  Top 0.254: v18.8,5.28 18.41,4.89 IC1.6
  Bottom 0.203: v18.8,5.28 19.96,6.45 v21.64,6.45
D+  (via drill 0.36)
  Top 0.254: USB1.D+ 11.33,6.96 12.75,8.38 v12.75,10.92
  Bottom 0.254: IC3.3 v12.75,10.92
D-  (via drill 0.36)
  Top 0.254: USB1.D- 10.94,7.76 11.48,8.31 v11.48,10.92
  Bottom 0.254: IC3.2 v11.48,10.92
DM  (via drill 0.36)
  Top 0.203: v22.55,9.22 22.96,9.62 IC1.16
  Bottom 0.203: IC3.7 11.48,7.21 11.91,7.64 21.29,7.64 22.55,8.91 v22.55,9.22
DP  (via drill 0.36)
  Top 0.203: IC1.15 23.61,9.36 v23.47,9.25
  Bottom 0.203: 12.73,4.33 12.78,4.38 12.78,7.01 13.06,7.29 21.77,7.29 23.42,8.94 v23.47,9.25
  Bottom 0.254: 12.73,4.33 IC3.6
GCLK1
  Top 0.406: R26.1 arc90 73.84,5.81 73.84,5.08 arc90 74.3,4.62 78.23,4.62 arc90 78.54,4.93 IC5.37
GND  (via drill 0.36)
  Top 0.203: 60.22,12.29 63.73,12.29
  Top 0.406: 63.73,12.29 JP5.2
  other vias: 56.11,9.8 71.32,14.1 19.58,4.65 21.31,9.25 28.96,7.92 31.17,14.17 37.67,4.04 43.36,2.9
  pour Top: -2.26,29.24 98.4,29.18 98.02,-3.63 -2.64,-3.58
  pour Bottom: 98.2,27.79 -2.16,28.4 -2.16,-2.95 98.2,-3.56
N$1
  Top 0.406: R19.2 arc90 90.87,17.14 LED5.C
N$2
  Top 0.305: LED2.A R4.1
N$3
  Top 0.305: R3.1 LED1.A
N$4
  Top 0.254: IC1.19 21.01,12.93 21.77,13.69 R1.1
N$5
  Top 0.406: LED6.C R20.2
N$6
  Top 0.305: R11.2 54,1.55 54,2.13 53.72,2.41 IC4.8
N$7
  Top 0.406: LED9.C R23.2
N$8  (via drill 0.36)
  Top 0.203: IC1.12 22.3,5.49 v22.86,6.04 | v27.15,13.69 R2.1
  Bottom 0.203: v27.15,13.69 26.11,13.69 24.49,12.06 24.49,7.67 v22.86,6.04
N$9
  Top 0.305: IC4.18 R8.1
N$10
  Top 0.305: IC4.16 R9.1
N$11
  Top 0.305: IC4.14 R10.1
N$12
  Top 0.406: LED7.C R21.2
N$13  (via drill 0.36)
  Top 0.203: IC8.P20 30.28,5.71 29.77,5.71 29.74,5.69 29.03,5.69 24.41,1.07 13.92,1.07 13.39,1.6 13.39,5.87 14.4,6.88 14.4,8.41 14.83,8.84 v14.83,8.94 | v9.98,12.29 10.02,12.33 R3.2
  Bottom 0.203: v14.83,8.94 14.73,9.04 14.73,11.63 14.45,11.91 10.34,11.91 9.98,12.27 v9.98,12.29
N$14
  Top 0.406: LED8.C R22.2
N$15
  Top 0.305: R13.1 52.45,1.61 IC4.7
N$16
  Top 0.305: IC4.5 49.84,3.51 49.84,2.13 49.22,1.52 R14.1
N$17
  Top 0.406: LED10.C R24.2
N$18
  Top 0.305: IC4.11 R12.2
N$19
  Top 0.406: LED11.C R25.2
N$20
  Top 0.406: R17.2 LED3.C
N$21
  Top 0.203: 60.2,9.7 60.22,9.73 62.84,9.73
N$22
  Top 0.254: IC5.12 arc-90 84.12,17.88
  Top 0.406: 84.12,17.88 84.12,19.48 arc-90 86.87,22.23 R17.1
N$23
  Top 0.254: IC5.11 arc-90 85.95,16.08 86.77,16.08 arc90 87.27,16.59 87.27,18.74 arc-90 88.21,19.68 R18.1
N$24
  Top 0.254: IC5.10 arc-90 85.96,15.29 86.94,15.29 arc90 87.63,15.98 87.66,16.13 arc-90 88.65,17.17 R19.1
N$25
  Top 0.254: IC5.8 86.77,13.66 arc79 87.68,14.22 arc-90 88.06,14.6 R20.1
N$26
  Top 0.254: IC5.6 R21.1
N$27
  Top 0.254: IC5.5 arc90 85.97,11.23 87.17,11.23 arc-90 88.21,10.18 arc101 R22.1
N$28
  Top 0.254: IC5.3 arc90 85.95,9.65 87.5,9.65 arc-90 87.78,9.37 87.78,7.19 arc90 87.99,6.98 R23.1
N$29
  Top 0.254: 86.87,8.86 IC5.2 | 86.87,8.86 arc90 86.87,8.86 | 86.87,8.86 arc-90 87.17,8.56 87.17,4.93 arc90 87.66,4.44 R24.1
N$30
  Top 0.406: R25.1 87.35,1.9 arc-90 84.15,5.1 84.15,6.25 arc90 IC5.44
N$35
  Top 0.406: LED4.C R18.2
N$39
  Top 0.406: IC6.3 66.97,8.69 68.43,8.69 arc-90 68.65,8.47 R27.2 arc-90 68.66,5.78 68.66,4.98 arc90 68.99,4.65 71.81,4.65 arc90 72.07,4.92 R26.2
N$40
  Top 0.406: IC6.6 71.04,8.71 71.04,8.69 arc90 70.44,8.09 | R27.1 70.44,8.09 | IC6.2 arc90 67,9.96 68.58,9.96 arc-90 70.44,8.09 | C17.1 arc90 70.44,12.7 70.44,8.09
ONCE
  Top 0.305: R8.2
  Top 0.406: R8.2 47.37,17.55 49.12,19.3 JP2.6
ONCS  (via drill 0.36)
  Top 0.305: R9.2 49.87,17.17 v49.02,17.17
  Bottom 0.406: v49.02,17.17 47.05,19.14 JP2.8
ONSTA
  Top 0.305: R12.1 56.22,17.17 55.37,17.17 54.59,17.96 51.61,17.96 50.88,18.69 50.88,20.02 50.32,20.57 48.46,20.57 47.19,21.84 JP2.7
OTCK
  Top 0.203: JP1.4 62.79,7.19
  Top 0.305: R13.2 50.98,1.28 50.98,0.71 51.16,0.53 56.52,0.53 57.71,1.73 57.71,6.25 58.99,7.2 JP1.4
  Bottom 0.305: JP2.1 54.97,21.84 57.43,19.38 57.43,9.6 JP1.4
OTDI  (via drill 0.36)
  Top 0.203: JP1.6 62.81,2.11
  Top 0.305: R10.2 52.44,17.12 v51.59,17.12
  Bottom 0.305: 45.8,15.65 45.8,12.24 55.97,2.07 | 45.8,15.65 45.8,20.65 44.6,21.84 JP2.9 | v51.59,17.12 50.11,15.65 45.8,15.65
  Bottom 0.406: 55.97,2.07 56,2.11 JP1.6
OTDO
  Top 0.305: R11.1 55.85,1.52 56.57,1.52 57.2,2.16 57.2,8.08 59.2,9.74 | 59.2,9.74 JP1.3 | JP2.3 52.3,21.84 52.3,22.05 53.37,23.11 56.97,23.11 57.61,22.48 57.61,21.16 58.14,20.62 59.49,20.62 60.15,19.96 60.15,18.8 59.46,18.11 59.16,18.11 57.35,16.31 57.35,11.16 59.2,9.74
OTMS  (via drill 0.36)
  Top 0.203: 62.87,4.65 60.22,4.65 60.07,4.65 58.55,3.12 58.55,1.07 v58.37,0.89 | v45.39,1.52 R14.2
  Top 0.305: 60.22,4.65 JP1.5
  Bottom 0.203: v58.37,0.89 46.03,0.89 v45.39,1.52
  Bottom 0.305: JP2.5 49.84,21.84 50.88,20.8 50.88,18.64 51.59,17.93 52.22,17.93 53.62,16.54 53.62,8.15 57.25,4.52 60.17,4.57 JP1.5
RD
  Top 0.203: IC1.13 22.99,3.41 22.99,5.31 23.95,6.27 26.31,6.27 27.69,7.64 27.69,9.65 28.68,10.64 30.41,10.64
  Top 0.254: IC8.P14 30.41,10.64
RXF
  Top 0.203: 30.39,6.63 30.27,6.5 29.31,6.5 24.23,1.42 14.17,1.42 13.77,1.83 13.77,5.71 14.81,6.76 14.81,8.08 16.1,9.37 18.09,9.37 18.41,9.69 IC1.23
  Top 0.254: IC8.P19 30.39,6.63
SNCE  (via drill 0.36)
  Top 0.203: IC4.2 46.1,5.33 v48.16,7.39 | v40.69,12.24 41.81,12.24 IC8.P44
  Bottom 0.203: v48.16,7.39 43.31,12.24 v40.69,12.24
SNCS  (via drill 0.36)
  Top 0.203: IC4.4 48.64,5.13 v48.62,5.16 | v40.21,11.46 IC8.P43
  Bottom 0.203: v48.62,5.16 48.62,5.89 43.05,11.46 v40.21,11.46
SNSTA
  Top 0.203: IC8.P35 41.87,5 44.81,5 47.78,7.98 48.44,7.98 49.76,6.65 53.7,6.65 54.99,5.36 IC4.9 | IC4.9
STCK  (via drill 0.36)
  Top 0.203: IC8.P33 v40.12,1.38 v40.11,1.37 | v45.31,6.68 47.32,8.69 52.2,8.69 53.72,10.21 IC4.13
  Bottom 0.203: v40.11,1.37 40.11,1.47 v45.31,6.68
STDI  (via drill 0.36)
  Top 0.203: IC4.6 51.18,5.84 50.78,6.25 47.98,6.25 v47.52,5.79 | IC8.P42 40.7,10.65 v40.69,10.64
  Bottom 0.203: v47.52,5.79 42.65,10.67 v40.69,10.64
STDO  (via drill 0.36)
  Top 0.203: IC8.P31 38.51,2.54 v38.51,1.4 | v44.22,7.11 46.63,9.52 v51.23,9.52 | v52.48,7.87 54.99,10.39 IC4.12
  Bottom 0.203: v38.51,1.4 v44.22,7.11 | v51.23,9.52 52.48,8.28 v52.48,7.87
STMS  (via drill 0.36)
  Top 0.203: IC8.P34 41.81,4.24 v40.11,4.24 | v43.51,7.92 46.05,10.46 50.8,10.46 51.18,10.84 IC4.15
  Top 0.305: IC4.15 51.16,13.61
  Bottom 0.203: v40.11,4.24 43.51,7.64 v43.51,7.92
TCK  (via drill 0.36)
  Top 0.406: v77.83,12.45 76.61,13.66 IC5.26
  Bottom 0.406: v77.83,12.45 77.83,6.86 arc-90 76.94,5.97 64.03,5.97 arc-90 JP5.4
TDI  (via drill 0.36)
  Top 0.406: v84.15,8.06 IC5.1
  Bottom 0.406: v84.15,8.06 84.15,4.19 arc-90 81.74,1.78 63.86,1.78 arc-90 63.52,2.11 JP5.6
TDO  (via drill 0.36)
  Top 0.406: v76.33,8.86 | v76.33,8.86 IC5.32
  Bottom 0.406: v76.33,8.86 arc-90 74.4,6.93 66.32,6.93 arc-90 63.5,9.75 62.84,9.75 arc90 JP5.3
TMS  (via drill 0.36)
  Top 0.406: 86.64,12.85 IC5.7 84.57,12.86 arc90 v83.9,12.19
  Bottom 0.406: v83.9,12.19 83.9,9.58 arc-90 83.36,9.04 arc84 82.88,8.61 82.88,4.11 arc-90 81.61,2.84 65.35,2.84 arc-90 63.55,4.65 JP5.5
TXE
  Top 0.203: 30.41,7.47 30.23,7.29 30.2,7.31 | IC1.22 19.05,9.81 18.26,9.02 16.33,9.02 15.24,7.92 15.24,6.63 14.17,5.56 14.17,2.03 14.43,1.78 23.93,1.78 29.59,7.44 30.41,7.44 IC8.P18
  Top 0.254: IC8.P18 30.41,7.47
USB_GND  (via drill 0.36)
  Top 0.254: USB1.GND 11.2,5.36 14.02,8.18 v14.02,10.92
  Bottom 0.254: IC3.4 v14.02,10.92
VBUS  (via drill 0.36)
  Top 0.254: USB1.VBUS 9.88,8.56 10.21,8.89 v10.21,10.92
  Bottom 0.254: IC3.1 v10.21,10.92
VCC  (via drill 0.36)
  Top 0.203: 64.92,13.74 64.69,14.58
  Top 0.406: 75.05,11.25 IC6.8 arc90 72.26,11.34 72.26,14.27 arc90 71.4,15.14 71.3,15.14 | 75.05,11.25 IC5.29 | 65.63,7.44 arc-90 64.92,8.15 64.92,13.74 arc90 63.3,15.37 63.3,15.29 arc-90 JP5.1 | 65.63,7.44 IC6.4 | 75.05,11.25 79.32,11.25 arc90 80.14,12.06 80.14,14.35 | 80.14,14.35 IC5.17 80.14,19.98 arc90 C13.1 C16.1 | 85.93,14.45 arc90 IC5.9 arc-90 85.93,14.45 | 83.62,14.45 80.24,14.45 arc90 80.14,14.35 | 83.62,14.45 v83.95,14.45 85.93,14.45 | C14.1 85.6,17.12 85.19,17.12 83.67,15.6 83.67,14.5 83.62,14.45 | R15.2 65.63,6.34 65.63,7.44 | LED11.A LED10.A LED9.A LED8.A LED7.A | LED7.A LED6.A LED5.A LED4.A LED3.A | LED7.A arc-90 95.71,12.04 v94.82,12.04 | C15.1 71.3,16.3 71.3,15.14 | 66.4,15.14 71.3,15.14 | 66.4,15.14 arc-90 65.51,16.03 R16.2 | 66.4,15.14 65.25,15.14 arc90 64.69,14.58
  Bottom 0.406: BAT1.1 94.79,12.06 arc-90 v94.82,12.04 94.82,14.55 arc90 93.29,16.08 85.57,16.08 arc90 v83.95,14.45
VCC_TARGET
  Top 0.203: JP1.1 62.84,14.81
  Top 0.305: 56.52,19.36 55.32,20.55 53.38,20.55 JP2.4
  Top 0.406: 56.52,19.36 JP3.1
  Bottom 0.406: JP3.1 60.25,17.98 JP1.1
WR
  Top 0.203: IC1.14 23.61,5.24 24.23,5.87 26.49,5.87 28.17,7.54 28.17,9.25 28.78,9.85 IC8.P15 | IC8.P15
  Top 0.254: IC8.P15 30.39,9.83

### Text on the board
tPlace: 1 | Power | 1 | Jump to | Target | VCC | GND | TDO | TCK | TMS | TDI
bPlace: nullspacelabs.com | NSL | [ | ]